# EAGLE board FOCDriver (EAGLE 7.7.0), part 1 of 2
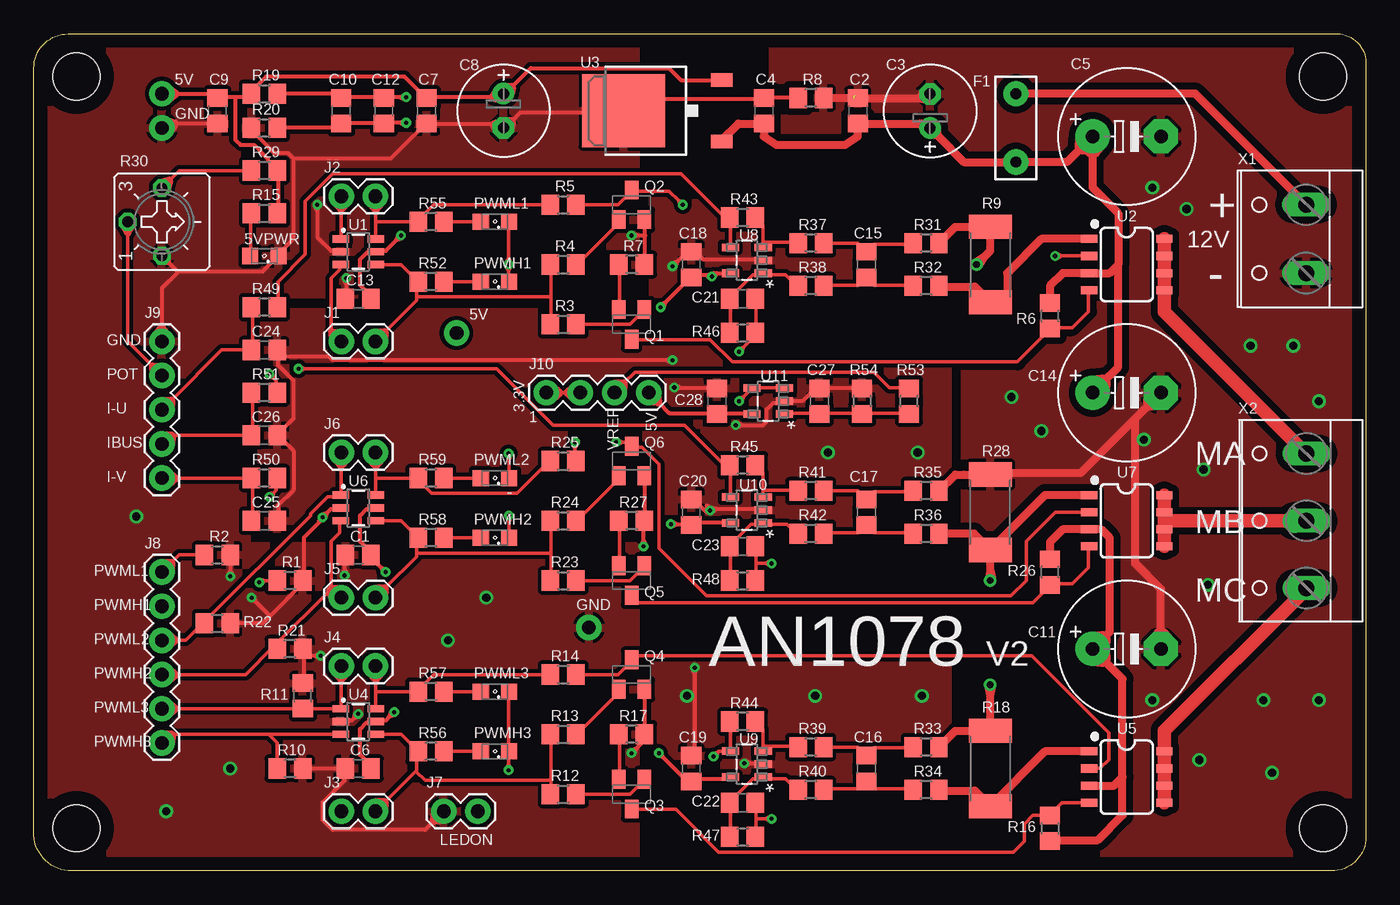
[diagram p2: board, top side]
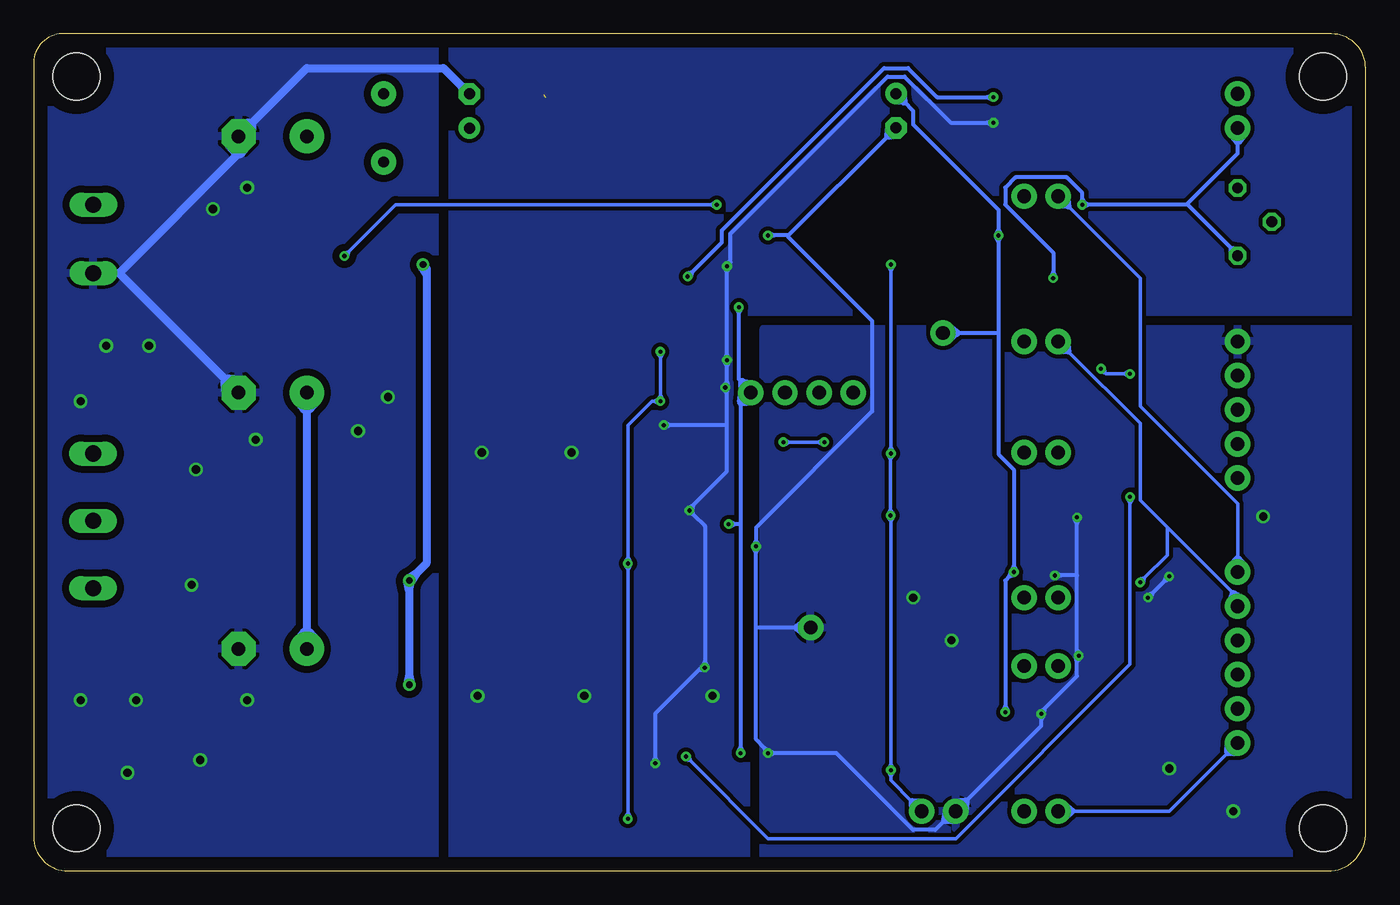
[diagram p3: board, bottom side, seen from below]

Size 99.08 x 62.25 mm. Coordinates in mm from the lower left corner, seen from the top.
Outline: 2.56,0 arc-90 0.02,3.17 0.02,59.69 arc-90 2.56,62.23 96.54,62.23 arc-90 99.08,60.33 99.08,2.54 arc-90 96.54,0 2.56,0
Copper layers (1*16): Top 0.035mm / dielectric 1.5mm / Bottom 0.035mm
Design rules "default *": minimum track width 10mil, minimum drill 12mil, track to track 8mil, track to pad 8mil, pad to pad 8mil, via to via 8mil, smd to smd 8mil, copper to edge 40mil, drill to drill 10mil, minimum pad ring 10mil, minimum via ring 8mil, stop-mask expansion 4mil, vias tented up to drill 20mil, thermal gap 10mil
Net classes: 0 default: width 0.254 mm, drill 0.254 mm, clearance 0.254 mm; 1 VccIn: width 0.305 mm, drill 0.254 mm, clearance 0.305 mm; 2 gnd: width 0.305 mm, drill 0.254 mm, clearance 0.305 mm; 3 +12V: width 0.61 mm, drill 0.508 mm, clearance 0.508 mm; 4 agnd: width 0.61 mm, drill 0.508 mm, clearance 0.508 mm; 5 5V: width 0.305 mm, drill 0.254 mm, clearance 0.305 mm; 6 MOTOR: width 1.016 mm, clearance 0.61 mm
Holes 3.5 mm at 95.9,59.05 95.9,3.17 3.19,3.17 3.19,59.05

## Footprints (pad centres in the part's own frame; a part is rotated, then mirrored left to right if it is on the bottom)
SML0805 = smd 1.2 x 1.2: A 1.05,0; C -1.05,0
C0805 = smd 1.3 x 1.5: 1 -0.95,0; 2 0.95,0
E2,5-7 = drill 0.813 pad 1.6: + -1.27,0 | drill 0.813 pad 1.6 octagon: - 1.27,0
E5-10,5 = drill 1.016 pad 2.54: + -2.54,0 | drill 1.016 pad 2.54 octagon: - 2.54,0
PTH = drill 0.8 pad 1.88: P$1 -2.54,0; P$2 2.54,0
1X02 = drill 1.016 pad 1.88: 1 0,0; 2 2.54,0
1X06 = drill 1.016 pad 1.88: 1 0,0; 2 2.54,0; 3 5.08,0; 4 7.62,0; 5 10.16,0; 6 12.7,0
1X05 = drill 1.016 pad 1.88: 1 0,0; 2 2.54,0; 3 5.08,0; 4 7.62,0; 5 10.16,0
1X04 = drill 1.016 pad 1.88: 1 0,0; 2 2.54,0; 3 5.08,0; 4 7.62,0
1X01_NO_SILK = drill 1.016 pad 1.88: 1 0,0
SOT23-BEC = smd 1 x 1.4: B -0.95,-1.1; C 0,1.1; E 0.95,-1.1
R0805 = smd 1.3 x 1.5: 1 -0.95,0; 2 0.95,0
R2512 = smd 1.8 x 3.2: 1 -2.8,0; 2 2.8,0
CT6 = drill 0.813 octagon: A 2.515,0; E -2.515,0; S 0,-2.54
SOT23-6 = smd 0.55 x 1.2: 1 0.95,1.3; 2 0,1.3; 3 -0.95,1.3; 4 -0.95,-1.3; 5 0,-1.3; 6 0.95,-1.3
SO08 = smd 0.6 x 1.2: 1 -1.905,-2.8; 2 -0.635,-2.8; 3 0.635,-2.8; 4 1.905,-2.8; 5 1.905,2.8; 6 0.635,2.8; 7 -0.635,2.8; 8 -1.905,2.8
TO-252 = smd 1 x 1.6: 1 -2.28,-4.8; 2 2.28,-4.8 | smd 5.4 x 6.2: 3 0,2.5
SOT95P285X120-5N = smd 1.27 x 0.559: 1 -1.219,0.965; 2 -1.219,0; 3 -1.219,-0.965; 4 1.219,-0.965; 5 1.219,0.965
W237-132 = drill 1.194 long: 1 -2.54,-0.635; 2 2.54,-0.635
W237-103 = drill 1.194 long: 1 -5,-1.29; 2 0,-1.29; 3 5,-1.29

## Placement (x,y rotation side)
5VPWR  ORANGE  [SML0805]  17.16,45.72 180 top
C1  0.1u  [C0805]  24.15,23.5 0 top
C2  0.1u  [C0805]  61.29,56.52 90 top
C3  47uF/50V  [E2,5-7]  66.67,56.5 90 top
C4  0.1u  [C0805]  54.31,56.52 90 top
C5  220uF/63V  [E5-10,5]  81.3,54.61 0 top
C6  0.1u  [C0805]  24.15,7.62 0 top
C7  0.1u  [C0805]  29.23,56.52 270 top
C8  47uF/50V  [E2,5-7]  34.94,56.52 270 top
C9  0.1u  [C0805]  13.67,56.52 270 top
C10  0.1u  [C0805]  22.88,56.52 270 top
C11  220uF/63V  [E5-10,5]  81.3,16.51 0 top
C12  0.1u  [C0805]  26.05,56.52 270 top
C13  0.1u  [C0805]  24.15,42.55 0 top
C14  220uF/63V  [E5-10,5]  81.3,35.56 0 top
C15  56p  [C0805]  61.93,45.09 270 top
C16  56p  [C0805]  61.93,7.62 270 top
C17  56p  [C0805]  61.93,26.67 270 top
C18  0.1u  [C0805]  48.91,45.09 90 top
C19  0.1u  [C0805]  48.91,7.62 90 top
C20  0.1u  [C0805]  48.91,26.67 90 top
C21  56p  [C0805]  52.72,42.55 0 top
C22  56p  [C0805]  52.72,5.08 0 top
C23  56p  [C0805]  52.72,24.13 0 top
C24  1n  [C0805]  17.16,38.73 0 top
C25  1n  [C0805]  17.16,26.04 0 top
C26  1n  [C0805]  17.16,32.38 0 top
C27  0.1u  [C0805]  58.44,34.92 90 top
C28  0.1u  [C0805]  50.82,34.92 90 top
F1  4A/30V  [PTH]  73.04,55.24 270 top
J1  [1X02]  22.88,39.37 0 top
J2  [1X02]  22.88,50.16 0 top
J3  [1X02]  22.88,4.45 0 top
J4  [1X02]  22.88,15.24 0 top
J5  [1X02]  22.88,20.32 0 top
J6  [1X02]  22.88,31.11 0 top
J7  [1X02]  33.04,4.45 180 top
J8  [1X06]  9.54,22.23 270 top
J9  [1X05]  9.54,29.21 90 top
J10  [1X04]  38.12,35.56 0 top
J11  [1X01_NO_SILK]  9.54,57.78 0 top
J12  [1X01_NO_SILK]  9.54,55.24 0 top
J13  [1X01_NO_SILK]  31.45,40.01 0 top
J14  [1X01_NO_SILK]  41.29,18.1 0 top
LED2  GREEN  [SML0805]  34.31,43.81 180 top
LED3  GREEN  [SML0805]  34.31,48.26 180 top
LED4  GREEN  [SML0805]  34.31,8.89 180 top
LED5  GREEN  [SML0805]  34.31,13.34 180 top
LED6  GREEN  [SML0805]  34.31,24.77 180 top
LED7  GREEN  [SML0805]  34.31,29.21 180 top
Q1  BC817  [SOT23-BEC]  44.47,40.64 180 top
Q2  BC817  [SOT23-BEC]  44.47,49.53 0 top
Q3  BC817  [SOT23-BEC]  44.47,5.71 180 top
Q4  BC817  [SOT23-BEC]  44.47,14.61 0 top
Q5  BC817  [SOT23-BEC]  44.47,21.59 180 top
Q6  BC817  [SOT23-BEC]  44.47,30.48 0 top
R1  4.7K  [R0805]  19.07,21.59 180 top
R2  4.7K  [R0805]  13.67,23.5 0 top
R3  1K  [R0805]  39.39,40.64 0 top
R4  1K  [R0805]  39.39,45.09 0 top
R5  1K  [R0805]  39.39,49.53 0 top
R6  330  [R0805]  75.58,41.27 90 top
R7  180  [R0805]  44.47,45.09 180 top
R8  0  [R0805]  57.8,57.47 180 top
R9  0.025R 2W 1%  [R2512]  71.14,45.09 270 top
R10  4.7K  [R0805]  19.07,7.62 180 top
R11  4.7K  [R0805]  20.02,13.02 90 top
R12  1K  [R0805]  39.39,5.71 0 top
R13  1K  [R0805]  39.39,10.16 0 top
R14  1K  [R0805]  39.39,14.61 0 top
R15  330  [R0805]  17.16,48.9 0 top
R16  330  [R0805]  75.58,3.17 270 top
R17  180  [R0805]  44.47,10.16 180 top
R18  0.025R 2W 1%  [R2512]  71.14,7.62 270 top
R19  0  [R0805]  17.16,57.78 0 top
R20  0  [R0805]  17.16,55.24 0 top
R21  4.7K  [R0805]  19.07,16.51 180 top
R22  4.7K  [R0805]  13.67,18.41 0 top
R23  1K  [R0805]  39.39,21.59 0 top
R24  1K  [R0805]  39.39,26.04 0 top
R25  1K  [R0805]  39.39,30.48 0 top
R26  330  [R0805]  75.58,22.23 90 top
R27  180  [R0805]  44.47,26.04 180 top
R28  0.025R 2W 1%  [R2512]  71.14,26.67 90 top
R29  5.6K  [R0805]  17.16,52.07 180 top
R30  10K  [CT6]  9.54,48.26 270 top
R31  1K  [R0805]  66.37,46.67 180 top
R32  1K  [R0805]  66.37,43.5 180 top
R33  1K  [R0805]  66.37,9.21 180 top
R34  1K  [R0805]  66.37,6.03 180 top
R35  1K  [R0805]  66.37,28.26 180 top
R36  1K  [R0805]  66.37,25.08 180 top
R37  1K  [R0805]  57.8,46.67 180 top
R38  1K  [R0805]  57.8,43.5 180 top
R39  1K  [R0805]  57.8,9.21 180 top
R40  1K  [R0805]  57.8,6.03 180 top
R41  1K  [R0805]  57.8,28.26 180 top
R42  1K  [R0805]  57.8,25.08 180 top
R43  20K  [R0805]  52.72,48.58 180 top
R44  20K  [R0805]  52.72,11.11 180 top
R45  20K  [R0805]  52.72,30.16 180 top
R46  20K  [R0805]  52.72,40.01 0 top
R47  20K  [R0805]  52.72,2.54 0 top
R48  20K  [R0805]  52.72,21.59 0 top
R49  1K  [R0805]  17.16,41.91 180 top
R50  1K  [R0805]  17.16,29.21 180 top
R51  1K  [R0805]  17.16,35.56 180 top
R52  330  [R0805]  29.54,43.81 180 top
R53  20K  [R0805]  65.1,34.92 90 top
R54  20K  [R0805]  61.61,34.92 270 top
R55  330  [R0805]  29.54,48.26 180 top
R56  330  [R0805]  29.54,8.89 180 top
R57  330  [R0805]  29.54,13.34 180 top
R58  330  [R0805]  29.54,24.77 180 top
R59  330  [R0805]  29.54,29.21 180 top
U1  SN74LVC2G17  [SOT23-6]  24.15,46.04 90 top
U2  AO4606  [SO08]  81.3,45.09 270 top
U3  BA7805FP  [TO-252]  46.37,56.52 90 top
U4  SN74LVC2G17  [SOT23-6]  24.15,11.11 90 top
U5  AO4606  [SO08]  81.3,6.99 270 top
U6  SN74LVC2G17  [SOT23-6]  24.15,26.99 90 top
U7  AO4606  [SO08]  81.3,26.04 270 top
U8  LMV321IDBVRG4  [SOT95P285X120-5N]  53.04,45.4 180 top
U9  LMV321IDBVRG4  [SOT95P285X120-5N]  53.04,7.94 180 top
U10  LMV321IDBVRG4  [SOT95P285X120-5N]  53.04,26.83 180 top
U11  LMV321IDBVRG4  [SOT95P285X120-5N]  54.63,34.92 180 top
X1  [W237-132]  94,46.99 90 top
X2  [W237-103]  93.36,26.04 90 top

## Tracks (layer width: path | path; a pad name or v marks a point on that pad's centre or on a via)
3V3FROMMCU
  Top 0.254: J10.2 39.64,35.56 | 39.64,35.56 | 39.64,35.56 39.13,35.56 | 39.13,35.56 | 39.13,35.56 J10.1
  Top 0.508: 39.13,35.56 38.58,36.07 | 39.64,35.56 40.19,35.05 | 39.64,35.56 | 39.64,35.56 40.19,35.05 | J10.2 40.19,35.05 | 39.64,35.56 40.19,36.07 | 39.64,35.56 | 39.64,35.56 40.19,35.05 | 39.64,35.56 | 39.64,35.56 40.19,36.07 | 40.19,36.07 | 39.64,35.56 40.19,35.05 | J10.2 40.19,35.05 | 39.64,35.56 40.19,36.07 | 39.64,35.56 40.19,36.07 | 40.19,36.07 | J10.2 40.19,36.07 | 39.64,35.56 40.19,35.05 | 40.19,35.05 | J10.2 40.19,35.05 | 39.64,35.56 40.19,36.07 | J10.2 40.19,36.07 | 39.64,35.56 40.19,35.05 | J10.2 40.19,35.05 | 39.64,35.56 40.19,36.07 | J10.2 40.19,36.07 | 39.13,35.56 38.58,35.05 | 39.13,35.56 | 39.13,35.56 38.58,36.07 | 38.58,36.07 | 39.13,35.56 | 39.13,35.56 38.58,35.05 | 39.13,35.56 38.58,36.07 | 39.13,35.56 | 39.13,35.56 38.58,35.05 | J10.1 38.58,35.05 | 39.13,35.56 38.58,36.07 | 38.58,36.07 | 39.13,35.56 38.58,36.07 | J10.1 38.58,36.07 | 39.13,35.56 38.58,35.05 | 38.58,35.05 | J10.1 38.58,35.05 | 39.13,35.56 38.58,36.07 | J10.1 38.58,36.07 | 39.13,35.56 38.58,35.05 | J10.1 38.58,35.05 | 39.13,35.56 38.58,36.07 | J10.1 38.58,36.07 | 39.13,35.56 38.58,35.05 | J10.1 38.58,35.05
5V  (via drill 0.3)
  Top 0.305: R15.2 18.18,48.9 18.18,52.07 R29.1 18.05,52.2 17.42,52.83 17.42,52.96 16.4,53.98 15.38,53.98 15,54.36 15,57.53 | 15,57.53 15.89,57.53 16.15,57.78 R19.1 16.21,57.98 17.29,59.05 27.58,59.05 29.1,57.53 C7.1 29.23,57.53 34.17,57.53 34.69,57.53 C8.+ 35.07,57.78 35.58,58.29 36.97,59.69 47.26,59.69 48.15,58.8 51.07,58.8 U3.2 | C6.2 25.04,7.62 25.04,7.87 24.27,8.64 24.27,10.54 24.78,11.05 25.42,11.05 U4.5 25.54,11.18 26.18,11.18 26.49,11.49 | U6.5 25.42,26.92 24.78,26.92 24.27,26.42 24.27,24.51 25.04,23.75 25.04,23.5 C1.2 25.04,23.37 25.86,22.55 | v26.81,11.81 26.49,11.49 | 25.86,22.55 v26.18,22.23 | C13.2 25.04,42.55 25.04,42.8 24.27,43.56 24.27,45.47 24.78,45.97 25.42,45.97 U1.5 25.54,46.1 26.18,46.1 27,46.92 | v27.32,47.24 27,46.92 | 10.56,57.78 | 10.56,57.78 J11.1 | 10.56,57.78 13.35,57.78 arc-90 C9.1 arc-90 13.74,57.53 15,57.53 | 26.49,11.49 26.88,11.62 v26.81,11.81 | 26.49,11.49 26.62,11.88 v26.81,11.81 | 25.86,22.55 25.99,22.16 v26.18,22.23 | 25.86,22.55 26.24,22.42 v26.18,22.23 | 27,46.92 27.39,47.05 v27.32,47.24 | 27,46.92 27.13,47.31 v27.32,47.24
  Top 0.61: 9.94,58.28 | 9.94,58.28 | 10.56,57.78 9.94,57.29 | 9.94,57.29 | C8.+ 34.78,57.32 34.17,57.53 34.53,58.06 C8.+ | C8.+ 34.93,58.28 35.58,58.29 35.42,57.67 C8.+ | 10.56,57.78 9.94,58.28 | 9.94,58.28 | 10.56,57.78 | 10.56,57.78 9.94,58.28 | 10.56,57.78 | 10.56,57.78 9.94,57.29 | 9.94,57.29 | 10.56,57.78 9.94,58.28 | 9.94,58.28 | J11.1 9.94,58.28 | 10.56,57.78 9.94,57.29 | J11.1 9.94,57.29 | 10.56,57.78 9.94,58.28 | 10.56,57.78 9.94,57.29 | 9.94,57.29 | 10.56,57.78 9.94,58.28 | J11.1 9.94,58.28 | 10.56,57.78 9.94,57.29 | 9.94,57.29 | J11.1 9.94,57.29 | 10.56,57.78 9.94,58.28 | J11.1 9.94,58.28 | 10.56,57.78 | 10.56,57.78 9.94,57.29 | J11.1 9.94,57.29 | 10.56,57.78 9.94,58.28 | J11.1 9.94,58.28 | 10.56,57.78 9.94,57.29 | J11.1 9.94,57.29
  Bottom 0.305: 26.81,12.27 26.81,21.59 26.5,21.9 | 26.81,12.27 v26.81,11.81 | v26.18,22.23 26.5,21.9 | 27.32,47.7 27.32,49.15 33.67,55.5 33.67,56.52 34.37,57.21 C8.+ | 27.32,47.7 v27.32,47.24 | 26.18,22.68 26.18,29.84 27.32,30.99 27.32,40.01 | 26.18,22.68 v26.18,22.23 | v27.32,47.24 27.32,46.79 | 27.32,46.79 27.32,40.01 | 26.63,11.9 | 26,22.32 | 27.14,47.33 | J13.1 30.43,40.01 | 30.43,40.01 | 30.43,40.01 27.32,40.01 | 26.63,11.9 | 26,22.32 | 27.14,47.33 | 26.63,11.9 | 26,22.32 | 27.14,47.33 | 27.5,47.15 | 27.14,47.15 | 26.81,12.27 | 26.81,12.27 26.63,11.9 | 26.81,12.27 | 26.81,12.27 26.63,11.9 | 26.81,12.27 26.63,11.9 | 26.63,11.9 | 26.18,22.68 | 26.18,22.68 26,22.32 | 26.18,22.68 | 26.18,22.68 26,22.32 | 26.18,22.68 26,22.32 | 26,22.32 | 27.14,47.15 | 27.5,47.15 | 27.32,47.7 | 27.32,47.7 27.14,47.33 | 27.32,47.7 | 27.32,47.7 27.14,47.33 | 27.32,47.7 27.14,47.33 | 27.14,47.33 | 27.32,46.79 | 27.32,46.79 27.5,47.15 | 27.5,47.15 | 27.32,46.79 27.14,47.15 | 27.14,47.15 | 26.63,11.9 | 26.81,12.27 26.63,11.9 | v26.81,11.81 26.63,11.9 | 26.81,12.27 | 26.81,12.27 27,11.9 | 27,11.9 | 26.81,12.27 | 26.81,12.27 26.63,11.9 | 26.63,11.9 | 26.81,12.27 | 26.63,11.9 | 26.81,12.27 26.63,11.9 | v26.81,11.81 26.63,11.9 | 26.81,12.27 27,11.9 | 27,11.9 | 27,11.9 | 26.81,12.27 27,11.9 | 27,11.9 | 26.81,12.27 26.63,11.9 | 26.63,11.9 | v26.81,11.81 26.63,11.9 | 26.81,12.27 27,11.9 | v26.81,11.81 27,11.9 | 26.81,12.27 26.63,11.9 | v26.81,11.81 26.63,11.9 | 26.81,12.27 27,11.9 | v26.81,11.81 27,11.9 | 26,22.32 | 26.18,22.68 26,22.32 | v26.18,22.23 26,22.32 | 26.18,22.68 | 26.18,22.68 26.36,22.32 | 26.36,22.32 | 26.18,22.68 | 26.18,22.68 26,22.32 | 26,22.32 | 26.18,22.68 | 26.5,21.9 26.37,22.29 v26.18,22.23 | 26.5,21.9 26.11,22.03 v26.18,22.23 | 26,22.32 | 26.18,22.68 26,22.32
  Bottom 0.305: v26.18,22.23 26,22.32 | 26.18,22.68 26.36,22.32 | 26.36,22.32 | 26.36,22.32 | 26.18,22.68 26.36,22.32 | 26.36,22.32 | 26.18,22.68 26,22.32 | 26,22.32 | v26.18,22.23 26,22.32 | 26.18,22.68 26.36,22.32 | v26.18,22.23 26.36,22.32 | 26.18,22.68 26,22.32 | v26.18,22.23 26,22.32 | 26.18,22.68 26.36,22.32 | v26.18,22.23 26.36,22.32 | 27.14,47.33 | 27.32,47.7 27.14,47.33 | v27.32,47.24 27.14,47.33 | 27.32,47.7 | 27.32,47.7 27.5,47.33 | 27.5,47.33 | 27.32,47.7 | 27.32,47.7 27.14,47.33 | 27.14,47.33 | 27.32,47.7 | 27.32,46.79 | 27.32,46.79 27.5,47.15 | v27.32,47.24 27.5,47.15 | 27.32,46.79 | 27.32,46.79 27.14,47.15 | 27.14,47.15 | 27.32,46.79 27.5,47.15 | 27.5,47.15 | 27.32,46.79 | 27.32,46.79 27.14,47.15 | v27.32,47.24 27.14,47.15 | 27.14,47.33 | 27.32,47.7 27.14,47.33 | v27.32,47.24 27.14,47.33 | 27.32,47.7 27.5,47.33 | 27.5,47.33 | 27.5,47.33 | 27.32,47.7 27.5,47.33 | 27.5,47.33 | 27.32,47.7 27.14,47.33 | 27.14,47.33 | v27.32,47.24 27.14,47.33 | 27.32,47.7 27.5,47.33 | v27.32,47.24 27.5,47.33 | 27.32,47.7 27.14,47.33 | v27.32,47.24 27.14,47.33 | 27.32,47.7 27.5,47.33 | v27.32,47.24 27.5,47.33 | 27.14,47.15 | 27.32,46.79 27.5,47.15 | 27.5,47.15 | 27.32,46.79 27.14,47.15 | v27.32,47.24 27.14,47.15 | 27.32,46.79 27.5,47.15 | v27.32,47.24 27.5,47.15 | 27.32,46.79 27.14,47.15 | v27.32,47.24 27.14,47.15
  Bottom 0.61: 31.05,40.5 | 30.43,40.01 31.05,40.5 | 30.43,40.01 31.05,39.51 | 31.05,39.51 | 31.05,39.51 | 30.43,40.01 | 30.43,40.01 31.05,39.51 | J13.1 31.05,39.51 | 30.43,40.01 31.05,40.5 | 31.05,40.5 | J13.1 31.05,40.5 | 30.43,40.01 | 30.43,40.01 31.05,39.51 | J13.1 31.05,39.51 | 30.43,40.01 | 30.43,40.01 31.05,40.5 | J13.1 31.05,40.5 | 30.43,40.01 31.05,39.51 | 30.43,40.01 31.05,39.51 | 31.05,39.51 | 30.43,40.01 31.05,39.51 | J13.1 31.05,39.51 | 30.43,40.01 31.05,40.5 | 31.05,40.5 | J13.1 31.05,40.5 | 30.43,40.01 31.05,39.51 | 30.43,40.01 31.05,40.5 | 30.43,40.01 31.05,39.51 | J13.1 31.05,39.51 | 30.43,40.01 31.05,40.5 | J13.1 31.05,40.5 | 34.37,57.21 35.01,57.29 C8.+ 34.45,57.85 34.37,57.21
AGND  (via drill 0.3, 0.61)
  Top 0.305: C25.2 18.18,26.04 18.18,27.18 19.32,28.32 19.32,31.24 18.18,32.38 C26.2 18.18,32.51 19.32,33.66 19.32,36.45 18.18,37.59 18.18,38.73 C24.2 18.31,38.23 21.99,38.23 22.24,37.97 47.06,37.97 | 58.18,35.81 58.44,35.81 C27.2 | 50.82,35.94 C28.2 50.69,35.94 48.1,35.94 | R54.1 61.61,35.94 58.56,35.94 C27.2 | R20.2 22.62,55.24 22.88,55.5 C10.2 23,55.63 26.05,55.63 C12.2 26.18,55.63 27.25,55.63 | 49.17,45.97 48.91,45.97 C18.2 | 49.86,26.87 49.17,27.56 48.91,27.56 C20.2 | 49.86,26.87 50.06,26.67 50.31,26.67 v50.31,26.8 | v49.17,15.11 49.17,14.66 | 49.17,14.66 49.17,8.64 C19.2 | v47.52,44.96 47.84,45.28 | 47.84,45.28 48.53,45.97 48.79,45.97 C18.2 | v27.7,55.63 27.25,55.63 | v47.64,35.94 48.1,35.94 | v47.52,37.97 47.06,37.97 | v50.31,26.8 50.45,26.95 | v50.31,26.8 50.35,26.6 | 27.61,55.44 | 47.43,37.79 | U8.2 54.25,45.47 49.8,45.47 49.29,45.97 C18.2 | v52.85,8 53.31,8 | 53.31,8 54.25,8 U9.2 | C27.2 58.06,35.81 57.17,34.92 U11.2 55.77,34.8 55.01,34.8 54.5,34.29 54.5,33.4 54.25,33.15 52.67,33.15 | 50.75,26.92 50.56,26.92 v50.31,26.8 | 50.75,26.92 54.25,26.92 U10.2 | v52.21,33.15 52.67,33.15 | 27.61,55.44 | 47.43,37.79 | 49.35,15.02 | 48.98,15.02 | 27.61,55.44 | 47.73,36.12 | 47.73,35.76 | 47.43,37.79 | 48.98,15.02 | 49.35,15.02 | 49.17,14.66 | 49.17,14.66 49.35,15.02 | 49.35,15.02 | 49.17,14.66 48.98,15.02 | 48.98,15.02 | 50.06,27.18 | 50.41,26.97 | 27.25,55.63 | 27.25,55.63 27.61,55.44 | 27.25,55.63 | 27.25,55.63 27.61,55.44 | 27.25,55.63 27.61,55.44 | 27.61,55.44 | 47.73,35.76 | 47.73,36.12 | 48.1,35.94 | 48.1,35.94 47.73,36.12 | 47.73,36.12 | 48.1,35.94 47.73,35.76 | 47.73,35.76 | 47.06,37.97 | 47.06,37.97 47.43,37.79 | 47.06,37.97 | 47.06,37.97 47.43,37.79 | 47.06,37.97 47.43,37.79
  Top 0.305: 47.43,37.79 | 53.31,8 | 53.31,8 52.94,8.18 | 53.31,8 | 52.94,7.82 | 53.31,8 52.94,8.18 | 52.94,8.18 | 52.94,8.18 | 53.31,8 52.94,7.82 | 52.94,7.82 | v52.85,8 52.94,7.82 | 52.94,7.82 | 52.67,33.15 | 52.67,33.15 52.3,33.33 | 52.67,33.15 | 52.3,32.97 | 52.67,33.15 52.3,33.33 | 52.3,33.33 | 52.3,33.33 | 52.67,33.15 52.3,32.97 | 52.3,32.97 | v52.21,33.15 52.3,32.97 | 52.3,32.97 | 49.17,14.66 | 49.17,14.66 49.35,15.02 | v49.17,15.11 49.35,15.02 | 49.17,14.66 | 49.17,14.66 48.98,15.02 | 48.98,15.02 | 49.17,14.66 49.35,15.02 | 49.35,15.02 | 49.17,14.66 | 49.17,14.66 48.98,15.02 | v49.17,15.11 48.98,15.02 | 48.98,15.02 | 49.17,14.66 49.35,15.02 | 49.35,15.02 | 49.17,14.66 48.98,15.02 | v49.17,15.11 48.98,15.02 | 49.17,14.66 49.35,15.02 | v49.17,15.11 49.35,15.02 | 49.17,14.66 48.98,15.02 | v49.17,15.11 48.98,15.02 | 50.06,27.18 50.11,26.77 | 50.11,26.77 | v50.31,26.8 50.11,26.77 | 50.06,27.18 50.41,26.97 | v50.31,26.8 50.41,26.97 | 50.06,27.18 50.11,26.77 | v50.31,26.8 50.11,26.77 | 50.06,27.18 50.41,26.97 | v50.31,26.8 50.41,26.97 | 49.86,26.87 50.19,26.63 | v50.31,26.8 50.19,26.63 | 49.86,26.87 | 49.86,26.87 50.25,26.99 | v50.31,26.8 50.25,26.99 | 49.86,26.87 50.19,26.63 | v50.31,26.8 50.19,26.63 | 49.86,26.87 50.25,26.99 | v50.31,26.8 50.25,26.99 | 50.75,26.92 50.35,27 v50.31,26.8 | 50.75,26.92 50.45,26.65 v50.31,26.8 | 47.84,45.28 47.45,45.15 v47.52,44.96 | 47.84,45.28 47.71,44.89 v47.52,44.96 | 27.61,55.44 | 27.25,55.63 27.61,55.44 | v27.7,55.63 27.61,55.44 | 27.25,55.63 | 27.25,55.63 27.61,55.81 | 27.61,55.81 | 27.25,55.63 | 27.25,55.63 27.61,55.44 | 27.61,55.44 | 27.25,55.63 | 27.61,55.44 | 27.25,55.63 27.61,55.44 | v27.7,55.63 27.61,55.44 | 27.25,55.63 27.61,55.81 | 27.61,55.81 | 27.61,55.81 | 27.25,55.63 27.61,55.81
  Top 0.305: 27.61,55.81 | 27.25,55.63 27.61,55.44 | 27.61,55.44 | v27.7,55.63 27.61,55.44 | 27.25,55.63 27.61,55.81 | v27.7,55.63 27.61,55.81 | 27.25,55.63 27.61,55.44 | v27.7,55.63 27.61,55.44 | 27.25,55.63 27.61,55.81 | v27.7,55.63 27.61,55.81 | 48.1,35.94 | 48.1,35.94 47.73,36.12 | v47.64,35.94 47.73,36.12 | 48.1,35.94 | 48.1,35.94 47.73,35.76 | 47.73,35.76 | 48.1,35.94 47.73,36.12 | 47.73,36.12 | 48.1,35.94 | 48.1,35.94 47.73,35.76 | v47.64,35.94 47.73,35.76 | 47.73,35.76 | 48.1,35.94 47.73,36.12 | 47.73,36.12 | 48.1,35.94 47.73,35.76 | v47.64,35.94 47.73,35.76 | 48.1,35.94 47.73,36.12 | v47.64,35.94 47.73,36.12 | 48.1,35.94 47.73,35.76 | v47.64,35.94 47.73,35.76 | 47.43,37.79 | 47.06,37.97 47.43,37.79 | v47.52,37.97 47.43,37.79 | 47.06,37.97 | 47.06,37.97 47.43,38.16 | 47.43,38.16 | 47.06,37.97 | 47.06,37.97 47.43,37.79 | 47.43,37.79 | 47.06,37.97 | 47.43,37.79 | 47.06,37.97 47.43,37.79 | v47.52,37.97 47.43,37.79 | 47.06,37.97 47.43,38.16 | 47.43,38.16 | 47.43,38.16 | 47.06,37.97 47.43,38.16 | 47.43,38.16 | 47.06,37.97 47.43,37.79 | 47.43,37.79 | v47.52,37.97 47.43,37.79 | 47.06,37.97 47.43,38.16 | v47.52,37.97 47.43,38.16 | 47.06,37.97 47.43,37.79 | v47.52,37.97 47.43,37.79 | 47.06,37.97 47.43,38.16 | v47.52,37.97 47.43,38.16 | 53.31,8 52.94,8.18 | 52.94,8.18 | 52.94,7.82 | 52.94,8.18 | 53.31,8 52.94,8.18 | v52.85,8 52.94,8.18 | 53.31,8 | 53.31,8 52.94,7.82 | 52.94,7.82 | 53.31,8 52.94,8.18 | 52.94,8.18 | 53.31,8 | 53.31,8 52.94,7.82 | v52.85,8 52.94,7.82 | 53.31,8 52.94,8.18 | v52.85,8 52.94,8.18 | 53.31,8 52.94,7.82 | v52.85,8 52.94,7.82 | 52.67,33.15 52.3,33.33 | 52.3,33.33 | 52.3,32.97 | 52.3,33.33 | 52.67,33.15 52.3,33.33 | v52.21,33.15 52.3,33.33 | 52.67,33.15 | 52.67,33.15 52.3,32.97 | 52.3,32.97 | 52.67,33.15 52.3,33.33 | 52.3,33.33
  Top 0.305: 52.67,33.15 | 52.67,33.15 52.3,32.97 | v52.21,33.15 52.3,32.97 | 52.67,33.15 52.3,33.33 | v52.21,33.15 52.3,33.33 | 52.67,33.15 52.3,32.97 | v52.21,33.15 52.3,32.97
  Bottom 0.305: 49.17,15.57 49.17,25.65 49.99,26.47 | 49.17,15.57 v49.17,15.11 | v50.31,26.8 49.99,26.47 | 47.52,33.15 47.52,29.72 50.06,27.18 | 47.52,33.15 47.52,35.5 | 47.52,35.5 47.52,35.94 | 47.52,35.94 47.52,36.38 | 47.52,36.38 47.52,37.52 | 47.52,37.52 v47.52,37.97 | v47.52,37.97 47.52,38.43 | 47.52,38.43 47.52,44.5 | 47.52,44.5 v47.52,44.96 | 50.06,27.18 50.31,26.92 v50.31,26.8 | 28.16,55.63 30.88,55.63 34.31,59.05 35.58,59.05 47.26,47.37 47.26,45.34 | 28.16,55.63 v27.7,55.63 | 47.26,45.34 47.52,45.09 v47.52,44.96 | v47.64,35.94 47.52,35.94 | 48.98,15.2 | 47.33,38.06 | 52.85,8.46 52.85,11.68 49.59,14.94 | 52.85,8.46 v52.85,8 | 49.59,14.94 49.42,15.11 v49.17,15.11 | 47.52,33.15 51.76,33.15 | 51.76,33.15 v52.21,33.15 | 48.98,15.2 | 47.33,38.06 | 52.67,8.09 | 52.12,32.97 | 52.67,8.09 | 52.12,32.97 | 48.98,15.2 | 47.7,44.87 | 47.33,44.87 | 27.79,55.81 | 27.79,55.44 | 47.7,37.88 | 47.33,37.88 | 47.33,38.06 | 49.17,15.57 | 49.17,15.57 48.98,15.2 | 49.17,15.57 | 49.17,15.57 48.98,15.2 | 49.17,15.57 48.98,15.2 | 48.98,15.2 | 47.33,44.87 | 47.7,44.87 | 47.52,44.5 | 47.52,44.5 47.7,44.87 | 47.7,44.87 | 47.52,44.5 47.33,44.87 | 47.33,44.87 | 27.79,55.44 | 27.79,55.81 | 28.16,55.63 | 28.16,55.63 27.79,55.81 | 27.79,55.81 | 28.16,55.63 27.79,55.44 | 27.79,55.44 | 47.33,37.88 | 47.7,37.88 | 47.52,37.52 | 47.52,37.52 47.7,37.88 | 47.7,37.88 | 47.52,37.52 47.33,37.88 | 47.33,37.88 | 47.52,38.43 | 47.52,38.43 47.33,38.06 | 47.52,38.43 | 47.52,38.43 47.33,38.06 | 47.52,38.43 47.33,38.06 | 47.33,38.06 | 52.85,8.46 | 52.85,8.46 53.03,8.09 | 52.67,8.09 | 52.85,8.46 | 52.67,8.09 | 52.85,8.46 52.67,8.09 | 52.67,8.09 | v52.85,8 52.67,8.09 | 52.85,8.46 53.03,8.09 | 53.03,8.09 | 53.03,8.09 | 51.76,33.15 | 51.76,33.15 52.12,33.33 | 52.12,32.97 | 51.76,33.15 | 52.12,32.97
  Bottom 0.305: 51.76,33.15 52.12,32.97 | 52.12,32.97 | v52.21,33.15 52.12,32.97 | 51.76,33.15 52.12,33.33 | 52.12,33.33 | 52.12,33.33 | 48.98,15.2 | 49.17,15.57 48.98,15.2 | v49.17,15.11 48.98,15.2 | 49.17,15.57 | 49.17,15.57 49.35,15.2 | 49.35,15.2 | 49.17,15.57 | 49.17,15.57 48.98,15.2 | 48.98,15.2 | 49.17,15.57 | 48.98,15.2 | 49.17,15.57 48.98,15.2 | v49.17,15.11 48.98,15.2 | 49.17,15.57 49.35,15.2 | 49.35,15.2 | 49.35,15.2 | 49.17,15.57 49.35,15.2 | 49.35,15.2 | 49.17,15.57 48.98,15.2 | 48.98,15.2 | v49.17,15.11 48.98,15.2 | 49.17,15.57 49.35,15.2 | v49.17,15.11 49.35,15.2 | 49.17,15.57 48.98,15.2 | v49.17,15.11 48.98,15.2 | 49.17,15.57 49.35,15.2 | v49.17,15.11 49.35,15.2 | 49.59,14.94 49.32,15.25 v49.17,15.11 | 49.59,14.94 49.18,14.91 v49.17,15.11 | 50.06,27.18 | 50.41,26.97 | 49.99,26.47 50.37,26.6 v50.31,26.8 | 49.99,26.47 50.12,26.86 v50.31,26.8 | 50.06,27.18 50.11,26.77 | 50.11,26.77 | v50.31,26.8 50.11,26.77 | 50.06,27.18 50.41,26.97 | v50.31,26.8 50.41,26.97 | 50.06,27.18 50.11,26.77 | v50.31,26.8 50.11,26.77 | 50.06,27.18 50.41,26.97 | v50.31,26.8 50.41,26.97 | 47.26,45.34 | 47.62,45.13 | 47.52,44.5 | 47.52,44.5 47.7,44.87 | v47.52,44.96 47.7,44.87 | 47.52,44.5 | 47.52,44.5 47.33,44.87 | 47.33,44.87 | 47.52,44.5 47.7,44.87 | 47.7,44.87 | 47.52,44.5 | 47.52,44.5 47.33,44.87 | v47.52,44.96 47.33,44.87 | 47.33,44.87 | 47.52,44.5 47.7,44.87 | 47.7,44.87 | 47.52,44.5 47.33,44.87 | v47.52,44.96 47.33,44.87 | 47.52,44.5 47.7,44.87 | v47.52,44.96 47.7,44.87 | 47.52,44.5 47.33,44.87 | v47.52,44.96 47.33,44.87 | 47.26,45.34 47.31,44.93 | 47.31,44.93 | v47.52,44.96 47.31,44.93 | 47.26,45.34 47.62,45.13 | v47.52,44.96 47.62,45.13 | 47.26,45.34 47.31,44.93 | v47.52,44.96 47.31,44.93 | 47.26,45.34 47.62,45.13 | v47.52,44.96 47.62,45.13
  Bottom 0.305: 28.16,55.63 | 28.16,55.63 27.79,55.81 | v27.7,55.63 27.79,55.81 | 28.16,55.63 | 28.16,55.63 27.79,55.44 | 27.79,55.44 | 28.16,55.63 27.79,55.81 | 27.79,55.81 | 28.16,55.63 | 28.16,55.63 27.79,55.44 | v27.7,55.63 27.79,55.44 | 27.79,55.44 | 28.16,55.63 27.79,55.81 | 27.79,55.81 | 28.16,55.63 27.79,55.44 | v27.7,55.63 27.79,55.44 | 28.16,55.63 27.79,55.81 | v27.7,55.63 27.79,55.81 | 28.16,55.63 27.79,55.44 | v27.7,55.63 27.79,55.44 | 47.52,35.5 47.79,35.8 v47.64,35.94 | 47.52,35.5 47.44,35.91 v47.64,35.94 | 47.52,36.38 47.44,35.98 v47.64,35.94 | 47.52,36.38 47.79,36.08 v47.64,35.94 | 47.33,38.06 | 47.52,37.52 | 47.52,37.52 47.7,37.88 | v47.52,37.97 47.7,37.88 | 47.52,37.52 | 47.52,37.52 47.33,37.88 | 47.33,37.88 | 47.52,37.52 47.7,37.88 | 47.7,37.88 | 47.52,37.52 | 47.52,37.52 47.33,37.88 | v47.52,37.97 47.33,37.88 | 47.52,38.43 47.33,38.06 | v47.52,37.97 47.33,38.06 | 47.52,38.43 | 47.52,38.43 47.7,38.06 | 47.7,38.06 | 47.52,38.43 | 47.52,38.43 47.33,38.06 | 47.33,38.06 | 47.52,38.43 | 47.33,37.88 | 47.52,37.52 47.7,37.88 | 47.7,37.88 | 47.52,37.52 47.33,37.88 | v47.52,37.97 47.33,37.88 | 47.52,37.52 47.7,37.88 | v47.52,37.97 47.7,37.88 | 47.52,37.52 47.33,37.88 | v47.52,37.97 47.33,37.88 | 47.33,38.06 | 47.52,38.43 47.33,38.06 | v47.52,37.97 47.33,38.06 | 47.52,38.43 47.7,38.06 | 47.7,38.06 | 47.7,38.06 | 47.52,38.43 47.7,38.06 | 47.7,38.06 | 47.52,38.43 47.33,38.06 | 47.33,38.06 | v47.52,37.97 47.33,38.06 | 47.52,38.43 47.7,38.06 | v47.52,37.97 47.7,38.06 | 47.52,38.43 47.33,38.06 | v47.52,37.97 47.33,38.06 | 47.52,38.43 47.7,38.06 | v47.52,37.97 47.7,38.06 | 52.85,8.46 53.03,8.09 | 52.85,8.46 | 52.85,8.46 52.67,8.09 | 52.67,8.09 | 52.85,8.46 52.67,8.09 | 52.67,8.09 | 52.85,8.46 | 52.85,8.46 52.67,8.09 | v52.85,8 52.67,8.09
  Bottom 0.305: 52.85,8.46 53.03,8.09 | 53.03,8.09 | 52.85,8.46 52.67,8.09 | v52.85,8 52.67,8.09 | 52.85,8.46 | 52.85,8.46 53.03,8.09 | 53.03,8.09 | 52.85,8.46 52.67,8.09 | 52.67,8.09 | v52.85,8 52.67,8.09 | 52.85,8.46 53.03,8.09 | v52.85,8 53.03,8.09 | 52.85,8.46 52.67,8.09 | v52.85,8 52.67,8.09 | 52.85,8.46 53.03,8.09 | v52.85,8 53.03,8.09 | 51.76,33.15 52.12,33.33 | 51.76,33.15 | 51.76,33.15 52.12,32.97 | 52.12,32.97 | 51.76,33.15 52.12,32.97 | 52.12,32.97 | 51.76,33.15 | 51.76,33.15 52.12,32.97 | v52.21,33.15 52.12,32.97 | 51.76,33.15 52.12,33.33 | 52.12,33.33 | 51.76,33.15 52.12,32.97 | v52.21,33.15 52.12,32.97 | 51.76,33.15 | 51.76,33.15 52.12,33.33 | 52.12,33.33 | 51.76,33.15 52.12,32.97 | 52.12,32.97 | v52.21,33.15 52.12,32.97 | 51.76,33.15 52.12,33.33 | v52.21,33.15 52.12,33.33 | 51.76,33.15 52.12,32.97 | v52.21,33.15 52.12,32.97 | 51.76,33.15 52.12,33.33 | v52.21,33.15 52.12,33.33
  other vias: 65.74,31.11 59.07,31.11 66.06,13.02 58.12,13.02 48.59,13.02
  pour Top: 53.36,50.16 67.96,50.16 67.96,0 46.37,0 46.05,25.4 16.84,25.4 17.16,41.59 46.05,41.59 46.05,62.23 53.36,62.23
  pour Bottom: 67.96,62.23 67.96,0 46.05,0 46.05,41.59 0.02,41.59 0.02,62.23
DGND  (via drill 0.3, 0.61)
  Top 0.305: Q6.E 45.48,29.34 45.48,26.04 R27.1 45.36,25.91 45.36,24.59 | Q4.E 45.48,13.46 45.48,10.16 R17.1 45.36,10.03 45.36,9.65 44.79,9.09 | v24.15,11.68 23.82,11.36 | 23.82,11.36 23.64,11.18 22.88,11.18 U4.2 | v21.48,26.29 21.8,26.61 | 21.8,26.61 22.12,26.92 22.75,26.92 U6.2 | J7.2 29.78,3.73 29.1,3.05 22.24,3.05 21.48,3.81 21.48,5.08 23.13,6.73 23.13,7.62 C6.1 R10.1 | v23.13,21.97 23.13,22.43 | 23.13,22.43 23.13,23.5 C1.1 | v44.47,8.76 44.79,9.09 | v45.36,24.13 45.36,24.59 | 10.69,44.58 17.04,44.58 18.18,45.72 5VPWR.C 18.18,45.85 19.32,46.99 19.32,52.96 | 10.1,45.16 9.54,45.72 R30.A | 10.1,45.16 10.69,44.58 | v21.1,49.53 21.1,49.07 | 21.1,49.07 21.1,47.12 22.12,46.1 22.75,46.1 U1.2 | 19.32,52.96 18.94,53.34 17.92,53.34 16.27,54.99 16.27,55.24 R20.1 | v23.26,44.07 23.26,43.61 | 23.26,43.61 23.26,42.55 C13.1 | 9.54,40.39 9.54,43.31 10.69,44.45 10.69,44.58 | 9.54,40.39 | 9.54,40.39 J9.5 | 45.48,47.24 45.48,45.09 R7.1 | 45.48,47.24 45.48,48.39 Q2.E | v44.47,47.24 44.92,47.24 | 44.92,47.24 45.48,47.24 | 19.32,52.96 26.56,52.96 29.1,55.5 C7.2 29.23,55.5 34.17,55.5 34.69,55.5 C8.- 35.07,55.24 35.58,55.75 36.21,56.39 43.83,56.39 U3.3 43.96,56.52 44.85,57.4 54.5,57.4 C4.2 54.63,57.53 56.85,57.53 R8.2 | R22.2 17.04,18.41 17.58,18.95 | 17.58,18.95 19.96,21.34 19.96,21.59 R1.1 20.08,21.72 20.08,24.77 21.23,25.91 | R11.2 20.08,13.97 20.08,16.51 R21.1 20.21,16 20.9,16 | v21.35,16 20.9,16 | 21.23,25.91 21.48,26.16 v21.48,26.29 | v16.21,20.32 16.48,20.05 | 16.48,20.05 16.53,20 | 16.53,20 17.58,18.95 | R2.2 14.62,22.36 | 14.62,22.36 14.62,22.29 | 14.62,22.29 v14.62,21.91 | 22.95,22.06 | 45.17,24.22 | J12.1 9.86,55.56 10.51,55.56 C9.2
  Top 0.305: 21.26,15.82 | 22.95,22.06 | 45.17,24.22 | 14.62,22.29 | 14.62,22.29 14.47,21.99 | 14.62,22.29 14.78,21.99 | 16.48,20.05 16.38,20.37 v16.21,20.32 | 16.48,20.05 16.16,20.15 v16.21,20.32 | 14.47,21.99 | 14.78,21.99 | 14.62,22.29 | 14.62,22.29 14.47,21.99 | 14.62,22.29 14.78,21.99 | 14.62,22.29 | 14.62,22.29 14.47,21.99 | v14.62,21.91 14.47,21.99 | 14.62,22.29 | 14.62,22.29 14.78,21.99 | 14.62,22.29 14.47,21.99 | 14.47,21.99 | v14.62,21.91 14.47,21.99 | 14.62,22.29 14.78,21.99 | v14.62,21.91 14.78,21.99 | 14.62,22.29 14.47,21.99 | v14.62,21.91 14.47,21.99 | 14.62,22.29 14.78,21.99 | v14.62,21.91 14.78,21.99 | 21.26,15.82 | 22.95,22.06 | 45.17,24.22 | 21.28,49.44 | 20.92,49.44 | 23.44,43.98 | 23.08,43.98 | 44.56,47.43 | 44.56,47.06 | 21.26,15.82 | 14.44,22 | 21.28,26.32 | 23.13,22.43 | 23.13,22.43 22.95,22.06 | 23.13,22.43 | 23.13,22.43 22.95,22.06 | 23.13,22.43 22.95,22.06 | 22.95,22.06 | 45.36,24.59 | 45.36,24.59 45.17,24.22 | 45.36,24.59 | 45.36,24.59 45.17,24.22 | 45.36,24.59 45.17,24.22 | 45.17,24.22 | 20.92,49.44 | 21.28,49.44 | 21.1,49.07 | 21.1,49.07 21.28,49.44 | 21.28,49.44 | 21.1,49.07 20.92,49.44 | 20.92,49.44 | 23.08,43.98 | 23.44,43.98 | 23.26,43.61 | 23.26,43.61 23.44,43.98 | 23.44,43.98 | 23.26,43.61 23.08,43.98 | 23.08,43.98 | 44.56,47.06 | 44.56,47.43 | 44.92,47.24 | 44.92,47.24 44.56,47.43 | 44.56,47.43 | 44.92,47.24 44.56,47.06 | 44.56,47.06 | 20.9,16 | 20.9,16 21.26,15.82 | 20.9,16 | 20.9,16 21.26,15.82 | 20.9,16 21.26,15.82 | 21.26,15.82 | 14.62,22.36 | 14.62,22.36 14.8,22 | 14.44,22 | 14.62,22.36 | 14.44,22 | 14.62,22.36 14.44,22 | 14.44,22 | v14.62,21.91 14.44,22 | 14.62,22.36 14.8,22 | 14.8,22 | 14.8,22 | 14.62,22.36 14.44,22 | 23.82,11.36 24.21,11.49 v24.15,11.68 | 23.82,11.36 23.95,11.75 v24.15,11.68 | 21.8,26.61 21.42,26.48 v21.48,26.29
  Top 0.305: 21.8,26.61 21.67,26.22 v21.48,26.29 | 21.23,25.91 21.58,26.11 | 21.58,26.11 | 21.23,25.91 | 21.23,25.91 21.28,26.32 | v21.48,26.29 21.28,26.32 | 21.23,25.91 21.58,26.11 | v21.48,26.29 21.58,26.11 | 21.23,25.91 21.28,26.32 | v21.48,26.29 21.28,26.32 | 22.95,22.06 | 23.13,22.43 22.95,22.06 | v23.13,21.97 22.95,22.06 | 23.13,22.43 | 23.13,22.43 23.31,22.06 | 23.31,22.06 | 23.13,22.43 | 23.13,22.43 22.95,22.06 | 22.95,22.06 | 23.13,22.43 | 22.95,22.06 | 23.13,22.43 22.95,22.06 | v23.13,21.97 22.95,22.06 | 23.13,22.43 23.31,22.06 | 23.31,22.06 | 23.31,22.06 | 23.13,22.43 23.31,22.06 | 23.31,22.06 | 23.13,22.43 22.95,22.06 | 22.95,22.06 | v23.13,21.97 22.95,22.06 | 23.13,22.43 23.31,22.06 | v23.13,21.97 23.31,22.06 | 23.13,22.43 22.95,22.06 | v23.13,21.97 22.95,22.06 | 23.13,22.43 23.31,22.06 | v23.13,21.97 23.31,22.06 | 44.79,9.09 44.4,8.96 v44.47,8.76 | 44.79,9.09 44.66,8.7 v44.47,8.76 | 45.17,24.22 | 45.36,24.59 45.17,24.22 | v45.36,24.13 45.17,24.22 | 45.36,24.59 | 45.36,24.59 45.54,24.22 | 45.54,24.22 | 45.36,24.59 | 45.36,24.59 45.17,24.22 | 45.17,24.22 | 45.36,24.59 | 45.17,24.22 | 45.36,24.59 45.17,24.22 | v45.36,24.13 45.17,24.22 | 45.36,24.59 45.54,24.22 | 45.54,24.22 | 45.54,24.22 | 45.36,24.59 45.54,24.22 | 45.54,24.22 | 45.36,24.59 45.17,24.22 | 45.17,24.22 | v45.36,24.13 45.17,24.22 | 45.36,24.59 45.54,24.22 | v45.36,24.13 45.54,24.22 | 45.36,24.59 45.17,24.22 | v45.36,24.13 45.17,24.22 | 45.36,24.59 45.54,24.22 | v45.36,24.13 45.54,24.22 | 21.1,49.07 | 21.1,49.07 21.28,49.44 | v21.1,49.53 21.28,49.44 | 21.1,49.07 | 21.1,49.07 20.92,49.44 | 20.92,49.44 | 21.1,49.07 21.28,49.44 | 21.28,49.44 | 21.1,49.07 | 21.1,49.07 20.92,49.44 | v21.1,49.53 20.92,49.44 | 20.92,49.44 | 21.1,49.07 21.28,49.44 | 21.28,49.44
  Top 0.305: 21.1,49.07 20.92,49.44 | v21.1,49.53 20.92,49.44 | 21.1,49.07 21.28,49.44 | v21.1,49.53 21.28,49.44 | 21.1,49.07 20.92,49.44 | v21.1,49.53 20.92,49.44 | 23.26,43.61 | 23.26,43.61 23.44,43.98 | v23.26,44.07 23.44,43.98 | 23.26,43.61 | 23.26,43.61 23.08,43.98 | 23.08,43.98 | 23.26,43.61 23.44,43.98 | 23.44,43.98 | 23.26,43.61 | 23.26,43.61 23.08,43.98 | v23.26,44.07 23.08,43.98 | 23.08,43.98 | 23.26,43.61 23.44,43.98 | 23.44,43.98 | 23.26,43.61 23.08,43.98 | v23.26,44.07 23.08,43.98 | 23.26,43.61 23.44,43.98 | v23.26,44.07 23.44,43.98 | 23.26,43.61 23.08,43.98 | v23.26,44.07 23.08,43.98 | 44.92,47.24 | 44.92,47.24 44.56,47.43 | v44.47,47.24 44.56,47.43 | 44.92,47.24 | 44.92,47.24 44.56,47.06 | 44.56,47.06 | 44.92,47.24 44.56,47.43 | 44.56,47.43 | 44.92,47.24 | 44.92,47.24 44.56,47.06 | v44.47,47.24 44.56,47.06 | 44.56,47.06 | 44.92,47.24 44.56,47.43 | 44.56,47.43 | 44.92,47.24 44.56,47.06 | v44.47,47.24 44.56,47.06 | 44.92,47.24 44.56,47.43 | v44.47,47.24 44.56,47.43 | 44.92,47.24 44.56,47.06 | v44.47,47.24 44.56,47.06 | 21.26,15.82 | 20.9,16 21.26,15.82 | v21.35,16 21.26,15.82 | 20.9,16 | 20.9,16 21.26,16.18 | 21.26,16.18 | 20.9,16 | 20.9,16 21.26,15.82 | 21.26,15.82 | 20.9,16 | 21.26,15.82 | 20.9,16 21.26,15.82 | v21.35,16 21.26,15.82 | 20.9,16 21.26,16.18 | 21.26,16.18 | 21.26,16.18 | 20.9,16 21.26,16.18 | 21.26,16.18 | 20.9,16 21.26,15.82 | 21.26,15.82 | v21.35,16 21.26,15.82 | 20.9,16 21.26,16.18 | v21.35,16 21.26,16.18 | 20.9,16 21.26,15.82 | v21.35,16 21.26,15.82 | 20.9,16 21.26,16.18 | v21.35,16 21.26,16.18 | 16.53,20 16.4,20.39 v16.21,20.32 | 16.53,20 16.15,20.13 v16.21,20.32 | 14.62,22.36 14.8,22 | 14.62,22.36 14.44,22 | 14.44,22 | 14.44,22 | 14.8,22 | 14.62,22.36 | 14.62,22.36 14.44,22 | v14.62,21.91 14.44,22
  Top 0.305: 14.62,22.36 14.8,22 | 14.8,22 | 14.62,22.36 | 14.62,22.36 14.44,22 | v14.62,21.91 14.44,22 | 14.62,22.36 | 14.62,22.36 14.8,22 | 14.62,22.36 14.44,22 | 14.44,22 | v14.62,21.91 14.44,22 | 14.62,22.36 14.8,22 | v14.62,21.91 14.8,22 | 14.62,22.36 14.44,22 | v14.62,21.91 14.44,22 | 14.62,22.36 14.8,22 | v14.62,21.91 14.8,22 | 10.1,45.16 10.05,45.79 R30.A | 10.1,45.16 9.48,45.24 R30.A
  Top 0.61: 10.04,39.77 | 9.05,39.77 | C8.- 34.53,54.97 34.17,55.5 34.78,55.71 C8.- | C8.- 34.93,55.74 35.58,55.75 35.42,55.13 C8.- | 9.54,40.39 9.05,39.77 | 9.05,39.77 | 9.05,39.77 | 9.54,40.39 | 9.54,40.39 9.05,39.77 | J9.5 9.05,39.77 | 9.54,40.39 10.04,39.77 | 10.04,39.77 | J9.5 10.04,39.77 | 9.54,40.39 | 9.54,40.39 9.05,39.77 | J9.5 9.05,39.77 | 9.54,40.39 | 9.54,40.39 10.04,39.77 | J9.5 10.04,39.77 | 9.54,40.39 9.05,39.77 | 9.54,40.39 9.05,39.77 | 9.05,39.77 | 9.54,40.39 9.05,39.77 | J9.5 9.05,39.77 | 9.54,40.39 10.04,39.77 | 10.04,39.77 | J9.5 10.04,39.77 | 9.54,40.39 9.05,39.77 | 9.54,40.39 10.04,39.77 | 9.54,40.39 9.05,39.77 | J9.5 9.05,39.77 | 9.54,40.39 10.04,39.77 | J9.5 10.04,39.77 | 29.78,3.73 30.57,3.81 J7.2 29.87,4.51 29.78,3.73 | 10.51,55.56 9.76,55.84 J12.1 10.08,54.9 10.51,55.56
  Bottom 0.305: 24.15,11.23 24.15,10.79 29.78,5.16 J7.2 30.62,4.45 31.28,3.79 32.02,3.05 33.67,3.05 39.39,8.76 44.01,8.76 | 24.15,11.23 v24.15,11.68 | 21.48,15.56 21.48,14.48 23.89,12.06 | 21.48,15.56 21.48,16 | 21.48,16 21.48,16.44 | 21.48,16.44 21.48,21.97 | 21.48,21.97 21.48,25.83 | 21.48,25.83 v21.48,26.29 | 23.89,12.06 24.15,11.81 v24.15,11.68 | 21.48,21.97 22.67,21.97 | 22.67,21.97 v23.13,21.97 | 44.01,8.76 v44.47,8.76 | 45.36,18.1 45.36,9.78 44.72,9.14 | 45.36,18.1 45.36,23.67 | 45.36,23.67 v45.36,24.13 | 44.72,9.14 44.47,8.89 v44.47,8.76 | 13.23,49.53 20.64,49.53 | 20.64,49.53 v21.1,49.53 | 10.06,46.37 9.54,45.85 R30.A | 10.06,46.37 13.23,49.53 | 23.26,44.53 23.26,45.97 26.81,49.53 26.81,50.8 26.05,51.56 22.24,51.56 21.1,50.42 21.1,49.99 | 23.26,44.53 v23.26,44.07 | v21.1,49.53 21.1,49.99 | 13.23,49.53 13.23,49.66 9.54,53.34 9.54,54.23 | 42.94,47.24 44.01,47.24 | 44.01,47.24 v44.47,47.24 | C8.- 35.52,54.67 42.94,47.24 | 45.36,24.59 45.36,25.53 36.72,34.16 36.72,40.89 42.94,47.12 42.94,47.24 | 45.36,24.59 v45.36,24.13 | 44.72,9.14 | 44.72,9.14 44.37,8.94 | 44.37,8.94 | 44.72,9.14 44.67,8.74 | v44.47,8.76 44.67,8.74 | v21.35,16 21.48,16 | v14.62,21.91 14.89,21.64 | 14.89,21.64 14.95,21.58 | 14.95,21.58 15.89,20.64 | 15.89,20.64 15.94,20.59 | 15.94,20.59 v16.21,20.32 | 23.04,21.79 | 44.38,8.58 | 45.17,24.22 | 21.01,49.35 | 20.92,49.62 | 23.08,44.16 | 44.38,47.06 | 9.54,54.23 | 9.54,54.23 J12.1 | J14.1 42.31,18.1 | 42.31,18.1 | 42.31,18.1 45.36,18.1 | 23.04,21.79 | 44.38,8.58 | 45.17,24.22 | 21.01,49.35 | 20.92,49.62 | 23.08,44.16 | 44.38,47.06 | 15.94,20.59 16.04,20.27 v16.21,20.32 | 15.94,20.59 16.26,20.49 v16.21,20.32 | 14.89,21.64 14.79,21.96 v14.62,21.91 | 14.89,21.64 14.57,21.74 v14.62,21.91
  Bottom 0.305: 24.33,11.59 | 23.97,11.59 | 21.66,26.2 | 21.3,26.2 | 23.04,21.79 | 44.38,8.58 | 45.54,24.04 | 45.17,24.04 | 45.17,24.22 | 21.01,49.35 | 20.92,49.62 | 23.08,44.16 | 44.38,47.06 | 23.97,11.59 | 24.33,11.59 | 24.15,11.23 | 24.15,11.23 24.33,11.59 | 24.33,11.59 | 24.15,11.23 23.97,11.59 | 23.97,11.59 | 21.3,26.2 | 21.66,26.2 | 21.48,25.83 | 21.48,25.83 21.66,26.2 | 21.66,26.2 | 21.48,25.83 21.3,26.2 | 21.3,26.2 | 22.67,21.97 | 22.67,21.97 23.04,21.79 | 22.67,21.97 | 22.67,21.97 23.04,21.79 | 22.67,21.97 23.04,21.79 | 23.04,21.79 | 44.01,8.76 | 44.01,8.76 44.38,8.58 | 44.01,8.76 | 44.01,8.76 44.38,8.58 | 44.01,8.76 44.38,8.58 | 44.38,8.58 | 45.17,24.04 | 45.54,24.04 | 45.36,23.67 | 45.36,23.67 45.54,24.04 | 45.54,24.04 | 45.36,23.67 45.17,24.04 | 45.17,24.04 | 45.36,24.59 | 45.36,24.59 45.17,24.22 | 45.36,24.59 | 45.36,24.59 45.17,24.22 | 45.36,24.59 45.17,24.22 | 45.17,24.22 | 20.64,49.53 | 20.64,49.53 21.01,49.35 | 20.64,49.53 | 20.64,49.53 21.01,49.35 | 20.64,49.53 21.01,49.35 | 21.01,49.35 | 21.1,49.99 | 21.1,49.99 20.92,49.62 | 21.1,49.99 | 21.1,49.99 20.92,49.62 | 21.1,49.99 20.92,49.62 | 20.92,49.62 | 23.26,44.53 | 23.26,44.53 23.08,44.16 | 23.26,44.53 | 23.26,44.53 23.08,44.16 | 23.26,44.53 23.08,44.16 | 23.08,44.16 | 44.01,47.24 | 44.01,47.24 44.38,47.06 | 44.01,47.24 | 44.01,47.24 44.38,47.06 | 44.01,47.24 44.38,47.06 | 44.38,47.06 | 23.89,12.06 | 24.25,11.86 | 24.15,11.23 | 24.15,11.23 24.33,11.59 | v24.15,11.68 24.33,11.59 | 24.15,11.23 | 24.15,11.23 23.97,11.59 | 23.97,11.59 | 24.15,11.23 24.33,11.59 | 24.33,11.59 | 24.15,11.23 | 24.15,11.23 23.97,11.59 | v24.15,11.68 23.97,11.59 | 23.97,11.59 | 24.15,11.23 24.33,11.59 | 24.33,11.59 | 24.15,11.23 23.97,11.59 | v24.15,11.68 23.97,11.59 | 24.15,11.23 24.33,11.59 | v24.15,11.68 24.33,11.59 | 24.15,11.23 23.97,11.59
  Bottom 0.305: v24.15,11.68 23.97,11.59 | 23.89,12.06 23.95,11.66 | 23.95,11.66 | v24.15,11.68 23.95,11.66 | 23.89,12.06 24.25,11.86 | v24.15,11.68 24.25,11.86 | 23.89,12.06 23.95,11.66 | v24.15,11.68 23.95,11.66 | 23.89,12.06 24.25,11.86 | v24.15,11.68 24.25,11.86 | 21.48,25.83 | 21.48,25.83 21.66,26.2 | v21.48,26.29 21.66,26.2 | 21.48,25.83 | 21.48,25.83 21.3,26.2 | 21.3,26.2 | 21.48,25.83 21.66,26.2 | 21.66,26.2 | 21.48,25.83 | 21.48,25.83 21.3,26.2 | v21.48,26.29 21.3,26.2 | 21.3,26.2 | 21.48,25.83 21.66,26.2 | 21.66,26.2 | 21.48,25.83 21.3,26.2 | v21.48,26.29 21.3,26.2 | 21.48,25.83 21.66,26.2 | v21.48,26.29 21.66,26.2 | 21.48,25.83 21.3,26.2 | v21.48,26.29 21.3,26.2 | 23.04,21.79 | 22.67,21.97 23.04,21.79 | v23.13,21.97 23.04,21.79 | 22.67,21.97 | 22.67,21.97 23.04,22.15 | 23.04,22.15 | 22.67,21.97 | 22.67,21.97 23.04,21.79 | 23.04,21.79 | 22.67,21.97 | 23.04,21.79 | 22.67,21.97 23.04,21.79 | v23.13,21.97 23.04,21.79 | 22.67,21.97 23.04,22.15 | 23.04,22.15 | 23.04,22.15 | 22.67,21.97 23.04,22.15 | 23.04,22.15 | 22.67,21.97 23.04,21.79 | 23.04,21.79 | v23.13,21.97 23.04,21.79 | 22.67,21.97 23.04,22.15 | v23.13,21.97 23.04,22.15 | 22.67,21.97 23.04,21.79 | v23.13,21.97 23.04,21.79 | 22.67,21.97 23.04,22.15 | v23.13,21.97 23.04,22.15 | 44.72,9.14 44.37,8.94 | v44.47,8.76 44.37,8.94 | 44.72,9.14 44.67,8.74 | v44.47,8.76 44.67,8.74 | 44.38,8.58 | 44.01,8.76 44.38,8.58 | v44.47,8.76 44.38,8.58 | 44.01,8.76 | 44.01,8.76 44.38,8.95 | 44.38,8.95 | 44.01,8.76 | 44.01,8.76 44.38,8.58 | 44.38,8.58 | 44.01,8.76 | 44.38,8.58 | 44.01,8.76 44.38,8.58 | v44.47,8.76 44.38,8.58 | 44.01,8.76 44.38,8.95 | 44.38,8.95 | 44.38,8.95 | 44.01,8.76 44.38,8.95 | 44.38,8.95 | 44.01,8.76 44.38,8.58 | 44.38,8.58 | v44.47,8.76 44.38,8.58 | 44.01,8.76 44.38,8.95
  Bottom 0.305: v44.47,8.76 44.38,8.95 | 44.01,8.76 44.38,8.58 | v44.47,8.76 44.38,8.58 | 44.01,8.76 44.38,8.95 | v44.47,8.76 44.38,8.95 | 45.17,24.22 | 45.36,23.67 | 45.36,23.67 45.54,24.04 | v45.36,24.13 45.54,24.04 | 45.36,23.67 | 45.36,23.67 45.17,24.04 | 45.17,24.04 | 45.36,23.67 45.54,24.04 | 45.54,24.04 | 45.36,23.67 | 45.36,23.67 45.17,24.04 | v45.36,24.13 45.17,24.04 | 45.36,24.59 45.17,24.22 | v45.36,24.13 45.17,24.22 | 45.36,24.59 | 45.36,24.59 45.54,24.22 | 45.54,24.22 | 45.36,24.59 | 45.36,24.59 45.17,24.22 | 45.17,24.22 | 45.36,24.59 | 45.17,24.04 | 45.36,23.67 45.54,24.04 | 45.54,24.04 | 45.36,23.67 45.17,24.04 | v45.36,24.13 45.17,24.04 | 45.36,23.67 45.54,24.04 | v45.36,24.13 45.54,24.04 | 45.36,23.67 45.17,24.04 | v45.36,24.13 45.17,24.04 | 45.17,24.22 | 45.36,24.59 45.17,24.22 | v45.36,24.13 45.17,24.22 | 45.36,24.59 45.54,24.22 | 45.54,24.22 | 45.54,24.22 | 45.36,24.59 45.54,24.22 | 45.54,24.22 | 45.36,24.59 45.17,24.22 | 45.17,24.22 | v45.36,24.13 45.17,24.22 | 45.36,24.59 45.54,24.22 | v45.36,24.13 45.54,24.22 | 45.36,24.59 45.17,24.22 | v45.36,24.13 45.17,24.22 | 45.36,24.59 45.54,24.22 | v45.36,24.13 45.54,24.22 | 21.01,49.35 | 20.92,49.62 | 20.64,49.53 21.01,49.35 | v21.1,49.53 21.01,49.35 | 20.64,49.53 | 20.64,49.53 21.01,49.71 | 21.01,49.71 | 20.64,49.53 | 20.64,49.53 21.01,49.35 | 21.01,49.35 | 20.64,49.53 | 21.1,49.99 20.92,49.62 | v21.1,49.53 20.92,49.62 | 21.1,49.99 | 21.1,49.99 21.28,49.62 | 21.28,49.62 | 21.1,49.99 | 21.1,49.99 20.92,49.62 | 20.92,49.62 | 21.1,49.99 | 21.01,49.35 | 20.64,49.53 21.01,49.35 | v21.1,49.53 21.01,49.35 | 20.64,49.53 21.01,49.71 | 21.01,49.71 | 21.01,49.71 | 20.64,49.53 21.01,49.71 | 21.01,49.71 | 20.64,49.53 21.01,49.35 | 21.01,49.35 | v21.1,49.53 21.01,49.35 | 20.64,49.53 21.01,49.71
  Bottom 0.305: v21.1,49.53 21.01,49.71 | 20.64,49.53 21.01,49.35 | v21.1,49.53 21.01,49.35 | 20.64,49.53 21.01,49.71 | v21.1,49.53 21.01,49.71 | 20.92,49.62 | 21.1,49.99 20.92,49.62 | v21.1,49.53 20.92,49.62 | 21.1,49.99 21.28,49.62 | 21.28,49.62 | 21.28,49.62 | 21.1,49.99 21.28,49.62 | 21.28,49.62 | 21.1,49.99 20.92,49.62 | 20.92,49.62 | v21.1,49.53 20.92,49.62 | 21.1,49.99 21.28,49.62 | v21.1,49.53 21.28,49.62 | 21.1,49.99 20.92,49.62 | v21.1,49.53 20.92,49.62 | 21.1,49.99 21.28,49.62 | v21.1,49.53 21.28,49.62 | 23.08,44.16 | 23.26,44.53 23.08,44.16 | v23.26,44.07 23.08,44.16 | 23.26,44.53 | 23.26,44.53 23.44,44.16 | 23.44,44.16 | 23.26,44.53 | 23.26,44.53 23.08,44.16 | 23.08,44.16 | 23.26,44.53 | 23.08,44.16 | 23.26,44.53 23.08,44.16 | v23.26,44.07 23.08,44.16 | 23.26,44.53 23.44,44.16 | 23.44,44.16 | 23.44,44.16 | 23.26,44.53 23.44,44.16 | 23.44,44.16 | 23.26,44.53 23.08,44.16 | 23.08,44.16 | v23.26,44.07 23.08,44.16 | 23.26,44.53 23.44,44.16 | v23.26,44.07 23.44,44.16 | 23.26,44.53 23.08,44.16 | v23.26,44.07 23.08,44.16 | 23.26,44.53 23.44,44.16 | v23.26,44.07 23.44,44.16 | 44.38,47.06 | 44.01,47.24 44.38,47.06 | v44.47,47.24 44.38,47.06 | 44.01,47.24 | 44.01,47.24 44.38,47.43 | 44.38,47.43 | 44.01,47.24 | 44.01,47.24 44.38,47.06 | 44.38,47.06 | 44.01,47.24 | 44.38,47.06 | 44.01,47.24 44.38,47.06 | v44.47,47.24 44.38,47.06 | 44.01,47.24 44.38,47.43 | 44.38,47.43 | 44.38,47.43 | 44.01,47.24 44.38,47.43 | 44.38,47.43 | 44.01,47.24 44.38,47.06 | 44.38,47.06 | v44.47,47.24 44.38,47.06 | 44.01,47.24 44.38,47.43 | v44.47,47.24 44.38,47.43 | 44.01,47.24 44.38,47.06 | v44.47,47.24 44.38,47.06 | 44.01,47.24 44.38,47.43 | v44.47,47.24 44.38,47.43 | 21.48,15.56 21.55,15.97 v21.35,16 | 21.48,15.56 21.2,15.87 v21.35,16 | 21.48,16.44 21.2,16.14 v21.35,16
  Bottom 0.305: 21.48,16.44 21.55,16.04 v21.35,16 | 15.89,20.64 16.02,20.25 v16.21,20.32 | 15.89,20.64 16.27,20.51 v16.21,20.32 | 14.95,21.58 14.82,21.97 v14.62,21.91 | 14.95,21.58 14.56,21.71 v14.62,21.91 | 10.06,46.37 9.44,46.24 R30.A | 10.06,46.37 10.05,45.73 R30.A
  Bottom 0.61: 41.69,18.59 | 41.69,18.59 | 10.04,54.85 | 9.54,54.23 10.04,54.85 | 10.04,54.85 | J7.2 29.87,4.38 29.78,5.16 30.57,5.08 J7.2 | J7.2 31.12,4.57 31.28,3.79 30.48,3.81 J7.2 | 42.31,18.1 41.69,18.59 | 41.69,18.59 | 41.69,17.6 | 42.31,18.1 | 42.31,18.1 41.69,18.59 | J14.1 41.69,18.59 | 42.31,18.1 | 42.31,18.1 41.69,17.6 | 41.69,17.6 | J14.1 41.69,17.6 | 42.31,18.1 41.69,18.59 | J14.1 41.69,18.59 | 42.31,18.1 | 42.31,18.1 41.69,17.6 | J14.1 41.69,17.6 | 42.31,18.1 41.69,17.6 | 42.31,18.1 41.69,18.59 | 42.31,18.1 41.69,17.6 | 41.69,17.6 | 42.31,18.1 41.69,18.59 | 41.69,18.59 | J14.1 41.69,18.59 | 42.31,18.1 41.69,17.6 | J14.1 41.69,17.6 | 42.31,18.1 41.69,18.59 | J14.1 41.69,18.59 | 42.31,18.1 41.69,17.6 | J14.1 41.69,17.6 | 9.54,54.23 10.04,54.85 | 9.05,54.85 | 9.54,54.23 | 9.54,54.23 10.04,54.85 | J12.1 10.04,54.85 | 9.54,54.23 | 9.54,54.23 9.05,54.85 | 9.05,54.85 | J12.1 9.05,54.85 | 9.54,54.23 10.04,54.85 | J12.1 10.04,54.85 | 9.54,54.23 | 9.54,54.23 9.05,54.85 | J12.1 9.05,54.85 | 9.54,54.23 9.05,54.85 | 9.54,54.23 10.04,54.85 | 9.54,54.23 9.05,54.85 | 9.05,54.85 | 9.54,54.23 10.04,54.85 | 10.04,54.85 | J12.1 10.04,54.85 | 9.54,54.23 9.05,54.85 | J12.1 9.05,54.85 | 9.54,54.23 10.04,54.85 | J12.1 10.04,54.85 | 9.54,54.23 9.05,54.85 | J12.1 9.05,54.85 | 35.52,54.67 35.43,55.31 C8.- 34.88,54.75 35.52,54.67
  other vias: 7.64,26.35 9.86,4.45 33.67,20.32 30.81,17.14 14.62,7.62
  pour Bottom: 44.78,0 44.78,40.32 0.02,40.32 0.02,0
  pour Top: 44.78,0 44.78,24.13 15.89,24.13 15.89,42.86 44.78,42.86 44.78,62.23 0.02,62.23 0.02,0
GND  (via drill 0.61)  (1 unrouted)
  Top 0.61: R35.1 68.54,29.47 R28.2 | 71.26,29.59 77.87,29.59 81.93,33.66 | C11.- 83.84,17.53 83.84,20.95 81.93,22.86 81.93,33.66 | 81.93,33.66 83.12,34.84 C14.- | 61.1,57.66 61.21,57.77 | R8.1 60.98,57.47 C2.2 65.92,57.47 | 65.92,57.47 66.37,57.47 C3.- | 65.92,57.47 66.54,57.29 C3.- | 65.92,57.47 66.25,58.02 C3.-
  Top 1.219: 83.84,17.53 83.34,16.94 C11.- 84.34,16.94 83.84,17.53 | 83.12,34.84 83.89,34.9 C14.- 83.18,35.61 83.12,34.84
  Bottom 0.61: C14.- 84.56,36.28 92.73,44.45 | 92.73,44.45 X1.1 | 92.73,44.45 83.84,53.34 83.84,53.59 C5.- 83.12,55.33 78.76,59.69 68.6,59.69 67.25,58.34 | 67.25,58.34 C3.- | 67.25,58.34 66.61,58.26 C3.- | 67.25,58.34 67.16,57.7 C3.-
  Bottom 1.219: C5.- 84.34,54.18 83.84,53.59 83.34,54.18 C5.- | C5.- 83.18,54.56 83.12,55.33 83.89,55.27 C5.- | 84.56,36.28 83.79,36.22 C14.- 84.5,35.51 84.56,36.28
  other vias: 85.74,49.21 93.68,39.05 87.01,29.84 87.33,21.27 91.46,12.7 92.09,7.3 86.69,8.26 74.95,32.7 83.2,50.8 82.57,32.07 72.72,35.24 83.2,12.7 95.58,12.7 90.5,39.05 95.58,34.92
  pour Top: 54.94,62.23 54.94,51.44 69.23,51.44 69.23,0 99.39,0 99.39,62.23
  pour Bottom: 69.23,62.23 99.39,62.23 99.39,0 69.23,0
H1  (via drill 0.3)
  Top 0.254: J1.1 22.16,40.09 22.12,40.13 22.12,44.07 22.75,44.7 22.75,45.09 U1.3 | 17.22,21.59 16.91,21.59 v16.78,21.46 | 17.22,21.59 R1.2 | 17.22,21.59 16.84,21.68 v16.78,21.46 | 17.22,21.59 16.95,21.3 v16.78,21.46
  Top 0.508: 22.16,40.09 22.19,39.34 J1.1 22.91,40.05 22.16,40.09
  Bottom 0.254: J8.2 9.54,20.32 9.87,20.65 14.78,25.56 | 14.78,25.56 16.78,27.56 16.78,33.27 22.16,38.65 J1.1 | v16.78,21.46 16.46,21.79 | 16.46,21.79 14.78,23.46 14.78,25.56 | 16.46,21.79 16.56,21.4 v16.78,21.46 | 16.46,21.79 16.84,21.68 v16.78,21.46
  Bottom 0.508: 9.87,20.65 9.21,20.29 J8.2 10.17,19.96 9.87,20.65 | 22.16,38.65 22.91,38.69 J1.1 22.19,39.4 22.16,38.65
H1O
  Top 0.254: 38.5,42.67 38.5,45.09 R4.1 | 38.5,42.67 38.5,40.64 R3.1 | U1.4 25.54,45.09 27.32,45.09 R52.2 28.47,43.81 28.47,42.67 | 28.47,42.67 28.47,42.42 26.14,40.09 J1.2 | 28.47,42.67 38.5,42.67
  Top 0.508: 26.14,40.09 25.39,40.05 J1.2 26.1,39.34 26.14,40.09
H2
  Top 0.254: 17.48,10.16 10.34,10.16 10.18,10.16 J8.6 | 17.48,10.16 22.75,10.16 U4.3 | R10.2 18.12,9.52 17.48,10.16
  Top 0.508: 10.34,10.16 9.59,10.21 J8.6 10.22,9.42 10.34,10.16
  Bottom 0.254: 21.86,4.45 14.62,4.45 10.26,8.81 J8.6 | 21.86,4.45 | 21.86,4.45 J3.1
  Bottom 0.508: 21.86,4.45 22.41,3.94 | 21.86,4.45 | 21.86,4.45 22.41,3.94 | J3.1 22.41,3.94 | 21.86,4.45 22.41,4.95 | 21.86,4.45 | 21.86,4.45 22.41,3.94 | 21.86,4.45 | 21.86,4.45 22.41,4.95 | 22.41,4.95 | 21.86,4.45 22.41,3.94 | J3.1 22.41,3.94 | 21.86,4.45 22.41,4.95 | 21.86,4.45 22.41,4.95 | 22.41,4.95 | J3.1 22.41,4.95 | 21.86,4.45 22.41,3.94 | 22.41,3.94 | J3.1 22.41,3.94 | 21.86,4.45 22.41,4.95 | J3.1 22.41,4.95 | 21.86,4.45 22.41,3.94 | J3.1 22.41,3.94 | 21.86,4.45 22.41,4.95 | J3.1 22.41,4.95 | 10.26,8.81 10.23,9.55 J8.6 9.51,8.84 10.26,8.81
H2O
  Top 0.254: 38.5,6.73 38.5,10.16 R13.1 | 38.5,6.73 38.5,5.71 R12.1 | U4.4 25.54,10.16 27.32,10.16 R56.2 28.47,8.89 28.47,7.49 28.4,7.43 | J3.2 26.14,5.16 28.4,7.43 | 38.5,6.73 29.1,6.73 28.4,7.43
  Top 0.508: 26.14,5.16 25.39,5.13 J3.2 26.1,4.42 26.14,5.16
H3
  Top 0.254: J5.1 22.18,21.02 | 22.18,21.02 22.16,21.04 22.12,21.08 22.12,24.51 22.75,25.15 22.75,26.04 U6.3 | 10.56,14.61 15.77,14.61 17.86,16.7 | 10.56,14.61 | 10.56,14.61 J8.4 | 22.18,21.02 22.01,20.85 17.86,16.7 | 17.86,16.7 18.05,16.51 R21.2
  Top 0.508: 10.56,14.61 10.01,15.11 | 10.56,14.61 10.01,14.1 | 10.56,14.61 | 10.56,14.61 10.01,15.11 | 10.01,15.11 | 10.56,14.61 | 10.56,14.61 10.01,14.1 | 10.56,14.61 10.01,15.11 | 10.56,14.61 | 10.56,14.61 10.01,14.1 | J8.4 10.01,14.1 | 10.56,14.61 10.01,15.11 | 10.01,15.11 | 10.56,14.61 10.01,15.11 | J8.4 10.01,15.11 | 10.56,14.61 10.01,14.1 | 10.01,14.1 | J8.4 10.01,14.1 | 10.56,14.61 10.01,15.11 | J8.4 10.01,15.11 | 10.56,14.61 10.01,14.1 | J8.4 10.01,14.1 | 10.56,14.61 10.01,15.11 | J8.4 10.01,15.11 | 10.56,14.61 10.01,14.1 | J8.4 10.01,14.1 | J5.1 22.19,20.29 22.16,21.04 22.91,21 J5.1 | J5.1 22.22,20.13 22.01,20.85 22.75,20.99 J5.1
H3O